# EAGLE design LevelShifter (EAGLE 9.2.1)
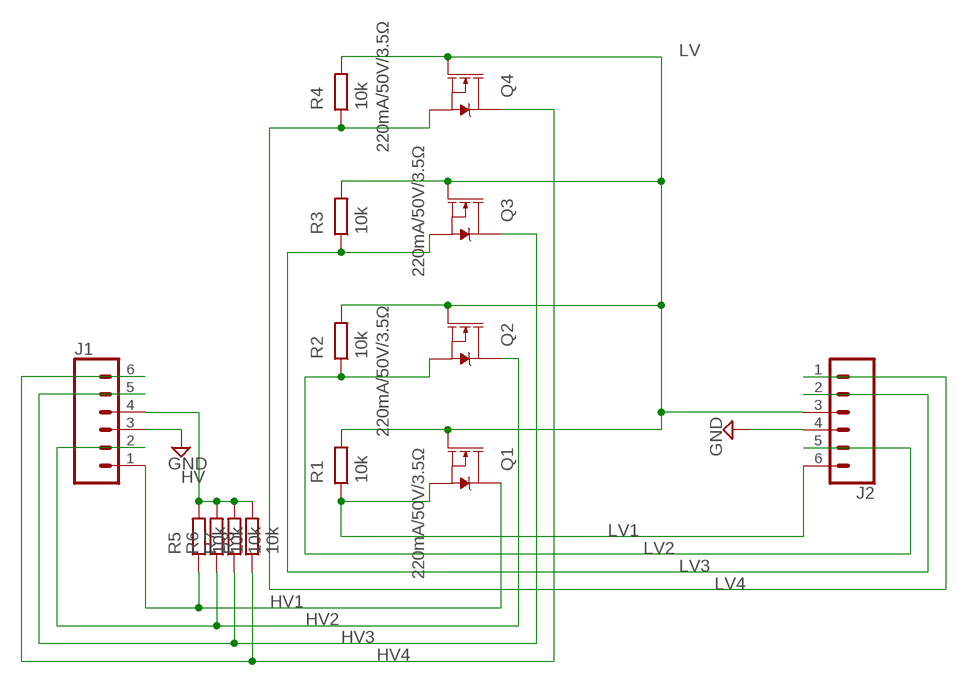
[diagram p0: schematic, sheet 1]

## Parts
J1  CONN_06NO_SILK_NO_POP  [1X06_NO_SILK]
J2  CONN_06NO_SILK_NO_POP  [1X06_NO_SILK]
Q1  220mA/50V/3.5Ω  MOSFET-NCH-BSS138  [SOT23-3]
Q2  220mA/50V/3.5Ω  MOSFET-NCH-BSS138  [SOT23-3]
Q3  220mA/50V/3.5Ω  MOSFET-NCH-BSS138  [SOT23-3]
Q4  220mA/50V/3.5Ω  MOSFET-NCH-BSS138  [SOT23-3]
R1  10k  R_CHIP-0603(1608-METRIC)  [RESC1608X60]
R2  10k  R_CHIP-0603(1608-METRIC)  [RESC1608X60]
R3  10k  R_CHIP-0603(1608-METRIC)  [RESC1608X60]
R4  10k  R_CHIP-0603(1608-METRIC)  [RESC1608X60]
R5  10k  R_CHIP-0603(1608-METRIC)  [RESC1608X60]
R6  10k  R_CHIP-0603(1608-METRIC)  [RESC1608X60]
R7  10k  R_CHIP-0603(1608-METRIC)  [RESC1608X60]
R8  10k  R_CHIP-0603(1608-METRIC)  [RESC1608X60]

## Nets
GND: J1.3 J2.4
HV: J1.4 R5.2 R6.2 R7.2 R8.2
HV1: J1.1 Q1.3(D) R5.1
HV2: J1.2 Q2.3(D) R6.1
HV3: J1.5 Q3.3(D) R7.1
HV4: J1.6 Q4.3(D) R8.1
LV: J2.3 Q1.1(G) Q2.1(G) Q3.1(G) Q4.1(G) R1.2 R2.2 R3.2 R4.2
LV1: J2.6 Q1.2(S) R1.1
LV2: J2.5 Q2.2(S) R2.1
LV3: J2.2 Q3.2(S) R3.1
LV4: J2.1 Q4.2(S) R4.1

## Library data of the parts
J1 J2 = SparkFun-Connectors:CONN_06: Multi connection point. Often used as Generic Header-pin footprint for 0.1 inch spaced/style header connections On any of the 0.1 inch spaced packages, you can populate with these: Break Away Headers - Straight <https://www.sparkfun.com/products/116> (PRT-00116) Break Away Male Headers - Right Angle <https://www.sparkfun.com/products/553> (PRT-00553) Female Headers <https://www.sparkfun.com/products/115> (PRT-00115) Break Away Headers - Machine Pin <https://www.sparkfun.com/products/117> (PRT-00117) Break Away Female Headers - Swiss Machine Pin <https://www.sparkfun.com/products/743> (PRT-00743) Arduino Stackable Header - 6 Pin <https://www.sparkfun.com/products/9280> (PRT-09280) For SCREWTERMINALS and SPRING TERMINALS visit here: Screw Terimnals on SparkFun.com <https://www.sparkfun.com/search/results?term=Screw+Terminals> (5mm/3.5mm/2.54mm spacing) This device is also useful as a general connection point to wire up your design to another part of your project. Our various solder wires solder well into these plated through hole pads. Hook-Up Wire - Assortment (Stranded, 22 AWG) <https://www.sparkfun.com/products/11375> (PRT-11375) Hook-Up Wire - Assortment (Solid Core, 22 AWG) <https://www.sparkfun.com/products/11367> (PRT-11367) View the entire wire category on our website here <https://www.sparkfun.com/categories/141>
Q1-Q4 = SparkFun-DiscreteSemi:MOSFET-NCH: N-channel MOSFETs Voltage controlled devices that allow control of high current outputs. SparkFun Products: SparkFun OpenScale <https://www.sparkfun.com/products/13261> SparkFun Digital Sandbox <https://www.sparkfun.com/products/12651> SparkFun Monster Moto Shield <https://www.sparkfun.com/products/10182> SparkFun MOSFET Power Controller <https://www.sparkfun.com/products/11214>; PROD_ID: TRANS-00830
R1-R8 = Resistor:R: Resistor Fixed - Generic; CATEGORY: Resistor; SUB-CATEGORY: Fixed

## Board
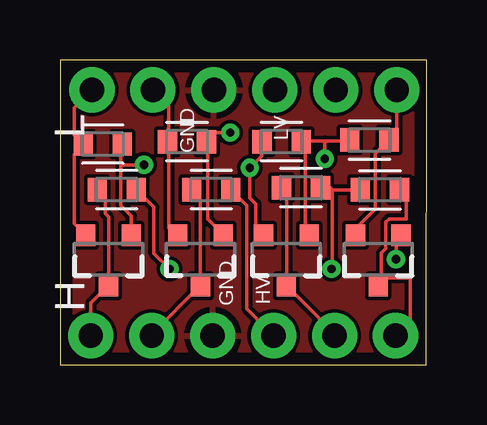
[diagram p1: board, top side]
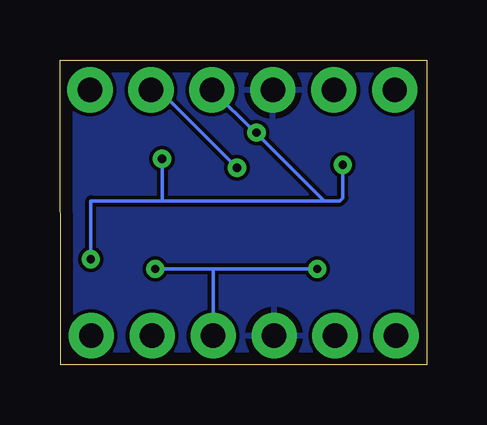
[diagram p2: board, bottom side, seen from below]

Size 15.28 x 12.72 mm. Coordinates in mm from the lower left corner, seen from the top.
Outline: 0,0 15.25,0 15.28,12.72 0,12.72 0,0
Copper layers (1*16): Top 0.035mm / dielectric 1.5mm / Bottom 0.035mm
Design rules "default *": minimum track width 6mil, minimum drill 0.35mm, track to track 6mil, track to pad 6mil, pad to pad 6mil, via to via 6mil, smd to smd 6mil, copper to edge 20mil, drill to drill 6mil, minimum pad ring 10mil, minimum via ring 8mil, stop-mask expansion 4mil, vias tented up to drill 0mil, thermal gap 10mil

### Footprints (pad centres in the part's own frame; a part is rotated, then mirrored left to right if it is on the bottom)
1X06_NO_SILK = drill 1.016 pad 1.88: 1 0,0; 2 2.54,0; 3 5.08,0; 4 7.62,0; 5 10.16,0; 6 12.7,0
SOT23-3 = smd 0.8 x 0.9: 1 -0.95,-1; 2 0.95,-1; 3 0,1.1
RESC1608X60 = smd 0.799 x 0.974: 1 -0.815,0; 2 0.815,0

### Placement (x,y rotation side)
J1  1.28,1.22 0 top
J2  14.03,11.47 180 top
Q1  2.02,4.41 180 top
Q2  5.85,4.41 180 top
Q3  9.43,4.41 180 top
Q4  13.26,4.41 180 top
R1  1.78,9.21 0 top
R2  5.29,9.31 0 top
R3  9.23,9.31 0 top
R4  12.89,9.38 180 top
R5  2.36,7.31 0 top
R6  6.3,7.31 0 top
R7  10.04,7.39 0 top
R8  13.33,7.3 180 top

### Tracks (layer width: path | path; a pad name or v marks a point on that pad's centre or on a via)
GND
  pour Top: 0.12,0 15.28,0 15.28,12.72 0.12,12.72
  pour Bottom: 0.12,0 15.28,0 15.28,12.72 0.12,12.72
HV  (via drill 0.35)
  Top 0.152: v4.56,4 3.91,4.66 3.91,6.58 R5.2 | 3.28,7.22 R5.2 | R8.2 11.34,7.3 | 11.03,7.3 10.95,7.3 R7.2 11.25,7.39 11.34,7.3 | R5.2 3.37,7.31 | J1.4 7.78,2.34 7.78,6.64 R6.2 | 11.34,7.3 11.34,4.03 v11.31,4
  Bottom 0.152: v4.56,4 8.91,4 | 8.91,4 v11.31,4 | J1.4 8.9,4 8.91,4
HV1
  Top 0.152: J1.1 1.28,2.59 1.91,3.22 Q1.3 2.02,6.17 1.87,6.31 1.87,7 1.66,7.22 R5.1
HV2
  Top 0.152: R6.1 5.53,7.22 5.85,6.9 5.85,3.34 5.88,3.31 Q2.3 | Q2.3 5.82,3.34 5.78,3.34 | Q2.3 3.82,1.28 J1.2
HV3
  Top 0.152: J1.5 11.41,1.22 11.41,1.34 9.53,3.22 Q3.3 9.44,7.19 9.28,7.34 R7.1
HV4
  Top 0.152: 13.28,3.22 | 13.28,3.22 Q4.3 13.26,3.49 13.39,3.62 | J1.6 14.59,1.83 14.59,3.62 13.39,3.62 | 13.34,3.28 13.28,3.22 | R8.1 14.43,7.02 14.43,6.09 13.71,6.09 13.71,6.08 13.58,5.95 13.58,4.85 13.39,4.66 13.39,3.62
LV  (via drill 0.35)
  Top 0.152: 10.16,9.22 R3.2 | 11.03,9.34 10.16,9.34 R3.2 | 11.03,9.34 12.03,9.34 R4.2 | Q2.1 6.78,5.47 6.16,6.09 6.16,9.22 R2.2 6.16,9.34 6.5,9.69 v7.09,9.69 | Q1.1 2.97,6.22 2.53,6.66 2.53,8.34 | 2.53,8.34 2.53,9.09 R1.2 2.6,9.19 | Q4.1 14,5.2 v14,4.41 | R3.2 10.23,9.13 10.23,5.56 Q3.1 | 11.03,9.34 v11.03,8.59 | v3.5,8.34 2.53,8.34
  Bottom 0.152: v14,4.41 14,6.84 11.03,6.84 | J2.3 8.94,11.47 7.16,9.69 v7.09,9.69 7.09,9.66 4.28,6.84 | v3.5,8.34 3.5,6.97 3.62,6.84 4.28,6.84 | 11.03,6.84 4.28,6.84 | v11.03,8.59 11.03,6.84
LV1
  Top 0.152: Q1.2 1.03,5.47 0.59,5.91 0.59,8.78 0.97,9.15 R1.1 | 0.91,9.09 R1.1 | 1.03,9.22 R1.1 | J2.6 0.59,10.73 0.59,9.58 R1.1
LV2
  Top 0.152: 4.53,9.22 4.53,5.72 4.78,5.47 Q2.2 | 4.53,9.22 R2.1 4.41,9.34 | J2.5 4.53,10.81 4.53,9.22
LV3  (via drill 0.35)
  Top 0.152: Q3.2 8.41,5.47 8.16,5.72 8.16,6.72 7.91,6.97 v7.91,8.22 8.41,8.72 8.41,9.22 R3.1
  Bottom 0.152: v7.91,8.22 11.16,11.47 J2.2
LV4
  Top 0.152: J2.1 14.03,9.72 13.78,9.47 R4.1 13.14,8.82 13.14,6.51 12.31,5.68 Q4.2

### Text on the board
tNames: L | GND | LV | HV | H | GND